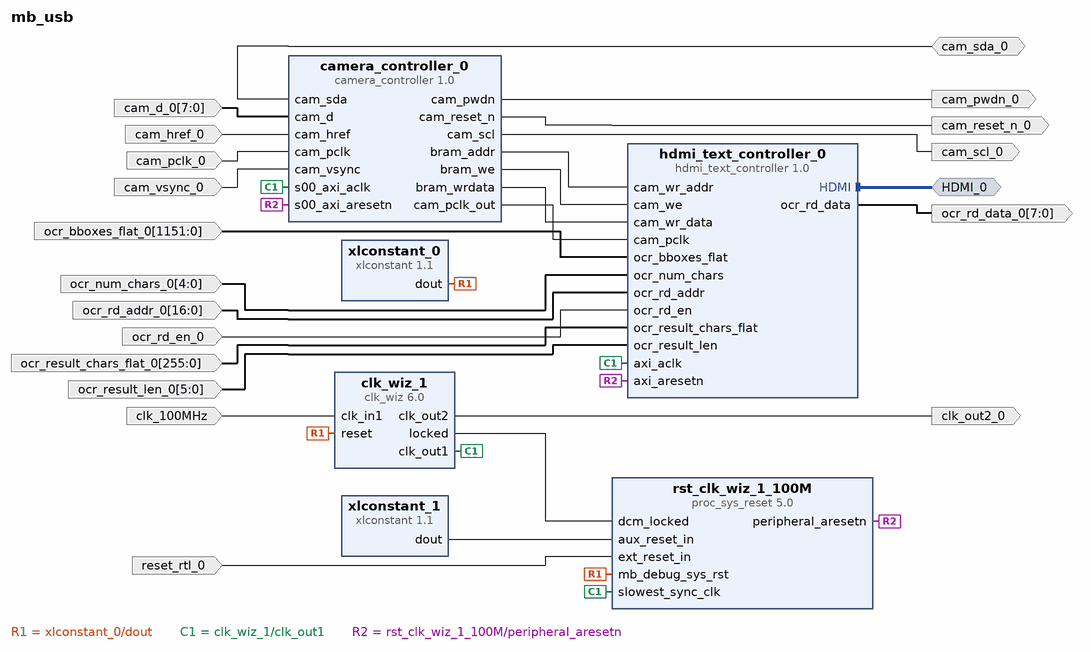
[diagram p0: block diagram of the top level]
# Vivado block design mb_usb, xc7s50csga324-1, Vivado 2022.2
create_bd_design mb_usb

create_bd_intf_port -mode Master -vlnv xilinx.com:interface:hdmi_rtl:2.0 HDMI_0
create_bd_port -dir I -type clk clk_100MHz
set_property -dict {CONFIG.FREQ_HZ 100000000} [get_bd_ports clk_100MHz]
create_bd_port -dir I -type rst reset_rtl_0
set_property -dict {CONFIG.POLARITY ACTIVE_LOW} [get_bd_ports reset_rtl_0]
create_bd_port -dir O -type clk clk_out2_0
create_bd_port -dir O cam_scl_0
create_bd_port -dir IO cam_sda_0
create_bd_port -dir O cam_pwdn_0
create_bd_port -dir O cam_reset_n_0
create_bd_port -dir I cam_vsync_0
create_bd_port -dir I cam_pclk_0
create_bd_port -dir I cam_href_0
create_bd_port -dir I -from 7 -to 0 cam_d_0
create_bd_port -dir I -from 1151 -to 0 ocr_bboxes_flat_0
create_bd_port -dir I -from 4 -to 0 ocr_num_chars_0
create_bd_port -dir I -from 255 -to 0 ocr_result_chars_flat_0
create_bd_port -dir I -from 5 -to 0 ocr_result_len_0
create_bd_port -dir I -from 16 -to 0 ocr_rd_addr_0
create_bd_port -dir I ocr_rd_en_0
create_bd_port -dir O -from 7 -to 0 ocr_rd_data_0

create_bd_cell -type ip -vlnv xilinx.com:ip:clk_wiz:6.0 clk_wiz_1
set_property -dict [list \
  CONFIG.CLKOUT1_JITTER 151.366 \
  CONFIG.CLKOUT1_PHASE_ERROR 132.063 \
  CONFIG.CLKOUT2_JITTER 202.114 \
  CONFIG.CLKOUT2_PHASE_ERROR 132.063 \
  CONFIG.CLKOUT2_REQUESTED_OUT_FREQ 24 \
  CONFIG.CLKOUT2_USED true \
  CONFIG.MMCM_CLKFBOUT_MULT_F 6.000 \
  CONFIG.MMCM_CLKIN1_PERIOD 10.0 \
  CONFIG.MMCM_CLKIN2_PERIOD 10.0 \
  CONFIG.MMCM_CLKOUT0_DIVIDE_F 6.000 \
  CONFIG.MMCM_CLKOUT1_DIVIDE 25 \
  CONFIG.NUM_OUT_CLKS 2 \
  CONFIG.PRIM_SOURCE Single_ended_clock_capable_pin \
] [get_bd_cells clk_wiz_1]
create_bd_cell -type ip -vlnv xilinx.com:ip:proc_sys_reset:5.0 rst_clk_wiz_1_100M
create_bd_cell -type ip -vlnv xilinx.com:ip:xlconstant:1.1 xlconstant_0
set_property -dict {CONFIG.CONST_VAL 0} [get_bd_cells xlconstant_0]
create_bd_cell -type ip -vlnv xilinx.com:ip:xlconstant:1.1 xlconstant_1
create_bd_cell -type ip -vlnv xilinx.com:user:camera_controller:1.0 camera_controller_0
create_bd_cell -type ip -vlnv xilinx.com:user:hdmi_text_controller:1.0 hdmi_text_controller_0

# ---- connections ----

connect_bd_intf_net [get_bd_intf_ports HDMI_0] [get_bd_intf_pins hdmi_text_controller_0/HDMI]
connect_bd_net [get_bd_ports cam_sda_0] [get_bd_pins camera_controller_0/cam_sda]
connect_bd_net -net cam_d_0_1 [get_bd_ports cam_d_0] [get_bd_pins camera_controller_0/cam_d]
connect_bd_net -net cam_href_0_1 [get_bd_ports cam_href_0] [get_bd_pins camera_controller_0/cam_href]
connect_bd_net -net cam_pclk_0_1 [get_bd_ports cam_pclk_0] [get_bd_pins camera_controller_0/cam_pclk]
connect_bd_net -net cam_vsync_0_1 [get_bd_ports cam_vsync_0] [get_bd_pins camera_controller_0/cam_vsync]
connect_bd_net [get_bd_pins camera_controller_0/bram_addr] [get_bd_pins hdmi_text_controller_0/cam_wr_addr]
connect_bd_net [get_bd_pins camera_controller_0/bram_we] [get_bd_pins hdmi_text_controller_0/cam_we]
connect_bd_net [get_bd_pins camera_controller_0/bram_wrdata] [get_bd_pins hdmi_text_controller_0/cam_wr_data]
connect_bd_net [get_bd_pins camera_controller_0/cam_pclk_out] [get_bd_pins hdmi_text_controller_0/cam_pclk]
connect_bd_net [get_bd_pins camera_controller_0/cam_pwdn] [get_bd_ports cam_pwdn_0]
connect_bd_net [get_bd_pins camera_controller_0/cam_reset_n] [get_bd_ports cam_reset_n_0]
connect_bd_net [get_bd_pins camera_controller_0/cam_scl] [get_bd_ports cam_scl_0]
connect_bd_net [get_bd_ports clk_100MHz] [get_bd_pins clk_wiz_1/clk_in1]
connect_bd_net [get_bd_pins clk_wiz_1/clk_out2] [get_bd_ports clk_out2_0]
connect_bd_net [get_bd_pins clk_wiz_1/locked] [get_bd_pins rst_clk_wiz_1_100M/dcm_locked]
connect_bd_net [get_bd_pins hdmi_text_controller_0/ocr_rd_data] [get_bd_ports ocr_rd_data_0]
connect_bd_net -net mdm_1_debug_sys_rst [get_bd_pins xlconstant_0/dout] \
  [get_bd_pins rst_clk_wiz_1_100M/mb_debug_sys_rst] [get_bd_pins clk_wiz_1/reset]
connect_bd_net -net microblaze_0_Clk_1 [get_bd_pins clk_wiz_1/clk_out1] \
  [get_bd_pins rst_clk_wiz_1_100M/slowest_sync_clk] [get_bd_pins camera_controller_0/s00_axi_aclk] \
  [get_bd_pins hdmi_text_controller_0/axi_aclk]
connect_bd_net -net ocr_bboxes_flat_0_1 [get_bd_ports ocr_bboxes_flat_0] [get_bd_pins hdmi_text_controller_0/ocr_bboxes_flat]
connect_bd_net -net ocr_num_chars_0_1 [get_bd_ports ocr_num_chars_0] [get_bd_pins hdmi_text_controller_0/ocr_num_chars]
connect_bd_net -net ocr_rd_addr_0_1 [get_bd_ports ocr_rd_addr_0] [get_bd_pins hdmi_text_controller_0/ocr_rd_addr]
connect_bd_net -net ocr_rd_en_0_1 [get_bd_ports ocr_rd_en_0] [get_bd_pins hdmi_text_controller_0/ocr_rd_en]
connect_bd_net -net ocr_result_chars_flat_0_1 [get_bd_ports ocr_result_chars_flat_0] [get_bd_pins hdmi_text_controller_0/ocr_result_chars_flat]
connect_bd_net -net ocr_result_len_0_1 [get_bd_ports ocr_result_len_0] [get_bd_pins hdmi_text_controller_0/ocr_result_len]
connect_bd_net -net reset_rtl_0_1 [get_bd_ports reset_rtl_0] [get_bd_pins rst_clk_wiz_1_100M/ext_reset_in]
connect_bd_net [get_bd_pins rst_clk_wiz_1_100M/peripheral_aresetn] \
  [get_bd_pins camera_controller_0/s00_axi_aresetn] [get_bd_pins hdmi_text_controller_0/axi_aresetn]
connect_bd_net [get_bd_pins xlconstant_1/dout] [get_bd_pins rst_clk_wiz_1_100M/aux_reset_in]

validate_bd_design
save_bd_design
